# Altium project Pmod_8LD.PrjPcb
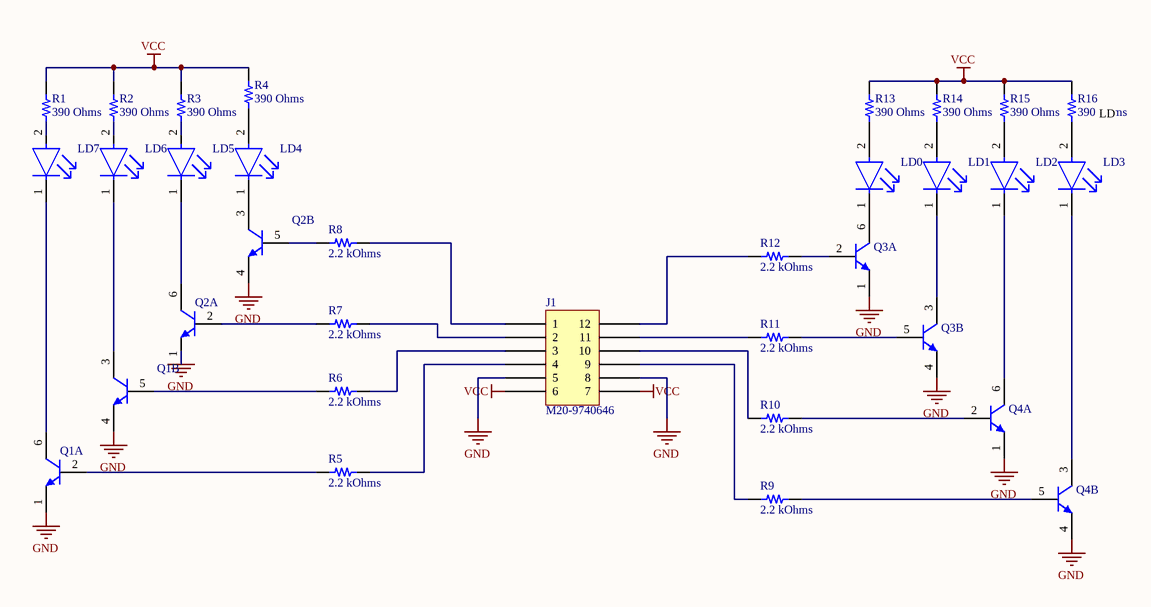
[diagram p0: Pmod_8LD.SchDoc]
1 sheet, 29 parts. Net scope: global (net labels, ports and power ports of the same name join across sheets).
Board file: Pmod_8LD.PcbDoc

## Sheet Pmod_8LD.SchDoc
size A4; SheetNumber: 1; SheetTotal: 1

### Parts
J1  M20-9740646  [HARWIN M20-9740645]
LD0  HSMG-C191  [FP-HSMG-C191-MFG]  (value not drawn)
LD1  HSMG-C191  [FP-HSMG-C191-MFG]  (value not drawn)
LD2  HSMG-C191  [FP-HSMG-C191-MFG]  (value not drawn)
LD3  HSMG-C191  [FP-HSMG-C191-MFG]  (value not drawn)
LD4  HSMG-C191  [FP-HSMG-C191-MFG]  (value not drawn)
LD5  HSMG-C191  [FP-HSMG-C191-MFG]  (value not drawn)
LD6  HSMG-C191  [FP-HSMG-C191-MFG]  (value not drawn)
LD7  HSMG-C191  [FP-HSMG-C191-MFG]  (value not drawn)
Q1  BC846BDW1T1G  [ONSC-SOT-363-6-419B-02_W_V]  (value not drawn)  (parts A,B of 2)
Q2  BC846BDW1T1G  [ONSC-SOT-363-6-419B-02_W_V]  (value not drawn)  (parts A,B of 2)
Q3  BC846BDW1T1G  [ONSC-SOT-363-6-419B-02_W_V]  (value not drawn)  (parts A,B of 2)
Q4  BC846BDW1T1G  [ONSC-SOT-363-6-419B-02_W_V]  (value not drawn)  (parts A,B of 2)
R1  390 Ohms  [RES 0805_2012]
R2  390 Ohms  [RES 0805_2012]
R3  390 Ohms  [RES 0805_2012]
R4  390 Ohms  [RES 0805_2012]
R5  2.2 kOhms  [RES 0805_2012]
R6  2.2 kOhms  [RES 0805_2012]
R7  2.2 kOhms  [RES 0805_2012]
R8  2.2 kOhms  [RES 0805_2012]
R9  2.2 kOhms  [RES 0805_2012]
R10  2.2 kOhms  [RES 0805_2012]
R11  2.2 kOhms  [RES 0805_2012]
R12  2.2 kOhms  [RES 0805_2012]
R13  390 Ohms  [RES 0805_2012]
R14  390 Ohms  [RES 0805_2012]
R15  390 Ohms  [RES 0805_2012]
R16  390 Ohms  [RES 0805_2012]

### Nets
GND: J1.5 J1.8 Q1.1(E) Q1.4(E) Q2.1(E) Q2.4(E) Q3.1(E) Q3.4(E) Q4.1(E) Q4.4(E)
VCC: J1.6 J1.7 R1.1 R2.1 R3.1 R4.1 R13.1 R14.1 R15.1 R16.1
NetJ1_1: J1.1 R8.1
NetJ1_2: J1.2 R7.1
NetJ1_3: J1.3 R6.1
NetJ1_4: J1.4 R5.1
NetJ1_9: J1.9 R9.2
NetJ1_10: J1.10 R10.2
NetJ1_11: J1.11 R11.2
NetJ1_12: J1.12 R12.2
NetLD0_1: LD0.1(C) Q3.6(C)
NetLD0_2: LD0.2(A) R13.2
NetLD1_1: LD1.1(C) Q3.3(C)
NetLD1_2: LD1.2(A) R14.2
NetLD2_1: LD2.1(C) Q4.6(C)
NetLD2_2: LD2.2(A) R15.2
NetLD3_1: LD3.1(C) Q4.3(C)
NetLD3_2: LD3.2(A) R16.2
NetLD4_1: LD4.1(C) Q2.3(C)
NetLD4_2: LD4.2(A) R4.2
NetLD5_1: LD5.1(C) Q2.6(C)
NetLD5_2: LD5.2(A) R3.2
NetLD6_1: LD6.1(C) Q1.3(C)
NetLD6_2: LD6.2(A) R2.2
NetLD7_1: LD7.1(C) Q1.6(C)
NetLD7_2: LD7.2(A) R1.2
NetQ1_2: Q1.2(B) R5.2
NetQ1_5: Q1.5(B) R6.2
NetQ2_2: Q2.2(B) R7.2
NetQ2_5: Q2.5(B) R8.2
NetQ3_2: Q3.2(B) R12.1
NetQ3_5: Q3.5(B) R11.1
NetQ4_2: Q4.2(B) R10.1
NetQ4_5: Q4.5(B) R9.1

### Notes on the sheet
- (near R16) LD

### Library data of the parts
J1 = M20-9740646: CONN HEADER R/A 12POS 2.54MM; Manufacturer: Harwin Inc.; Connector Type: Header, Cuttable; Current Rating (Amps): 3A per Contact; Material Flammability Rating: UL94 V-0; Number of Positions: 12; Number of Positions Loaded: All; Shrouding: Unshrouded; Style: Board to Board or Cable; Part Number: M20-9740646; ComponentLink1Description: Datasheet; ComponentLink1URL: https://cdn.harwin.com/pdfs/M20-974.pdf; ComponentLink2Description: DigiKey Link; ComponentLink2URL: http://digikey.com/product-detail/en/harwin-inc/M20-9740646/M20-9740646-ND/3920719; Contact Finish - Mating: Tin; Contact Finish - Post: Tin; Contact Material: Brass; Contact Shape: Square; Contact Type: Male Pin; Fastening Type: Push-Pull; Insulation Color: Black; Insulation Material: Polyamide (PA6T), Nylon 6T; LastUpdated: 21.09.2022 19:18:29; Lifecycle Status: Active; Minimum Order: 1500; Mounting Type: Through Hole, Right Angle; Number of Rows: 2; Operating Temperature: -40°C ~ 105°C; Packaging: Bulk; PartId: 159; Part Status: Active; Price: 0.27; Series: M20; Supplier 1: DigiKey; Supplier Part Number 1: M20-9740646-ND; Termination: Solder
LD0-LD7 = CMP-18399-000001-1: LED GREEN DIFFUSED CHIP SMD; Manufacturer: Broadcom; Viewing Angle: 170°; Max Junction Temp: +95°C; Wavelength: 572nm; Peak Emmision Wavelength: 570nm; Led Orientation: Top View; Luminous Intensity: 15mcd; Reverse Voltage: 5V; Forward Current: 20mA; Forward Voltage: 2.2V; Power Dissipation: 52mW; Ipc Land Pattern Name: DIOC16080X45; Digikey Description: LED GREEN DIFFUSED CHIP SMD; Temperature Range High: +85°C; Height: 0.7mm; Automotive: No; Footprint 0 Description: SM LED; 2 Flat Leads; Device Class L3: unset; ComponentLink2Description: Datasheet; Lead Free: Yes; Package: 0; Mouser Description: LED Uni-Color Green 570nm 2-Pin Chip LED T/R; RoHS: TRUE; Category: Diode; Manufacturer Part Number: HSMG-C191; Device Class L1: Optoelectronics; Temperature Range Low: -40°C; Device Class L2: LEDs; Colour: Green; Octopart: https://octopart.com/hsmg-c191-broadcom-71131308; Temperature: -40°C to +85°C; ComponentLink2URL: https://docs.broadcom.com/docs/AV02-0551EN
Q1-Q4 = CMP-1048-00850-1: Dual General Purpose Transistors, NPN, 6-Pin SOT-363, Pb-Free, Tape and Reel; Manufacturer: On Semiconductor; IC Continuous (A): 0.1; fT Min (MHz): 100; Polarity: Dual NPN; PartNumber: BC846BDW1T1G; ComponentLink3Description: Package Specification; PackageVersion: Rev. W, 01/2006; ComponentLink2URL: http://www.onsemi.cn/pub_link/Collateral/BC846BDW1T1-D.PDF; PackageDescription: 6-Pin Small Outline Transistor, Body 2 x 1.25 mm, Pitch 0.65 mm; ComponentLink2Description: Datasheet; PackageReference: SOT-363-6-419B-02_W; RoHS: TRUE; ComponentLink3URL: http://www.onsemi.com/pub_link/Collateral/NTJD4001N-D.PDF; DatasheetVersion: Rev. 9; ComponentLink1Description: Manufacturer URL; Mounting Technology: Surface Mount; Packing: Tape and Reel; ComponentLink1URL: http://www.onsemi.com/
R1-R4 R13-R16 = AC0805JR-07390RL: RES SMD 390 OHM 5% 1/8W 0805; Manufacturer: Yageo; Power (Watts): 0.125W, 1/8W; Temperature Coefficient: ±100ppm/°C; Part Number: AC0805JR-07390RL; Value: 390 Ohms; ComponentLink1Description: Datasheet; ComponentLink1URL: https://www.yageo.com/upload/media/product/productsearch/datasheet/rchip/PYu-AC_51_RoHS_L_7.pdf; ComponentLink2Description: DigiKey Link; ComponentLink2URL: https://www.digikey.com/en/products/detail/yageo/AC0805JR-07390RL/5897130; Composition: Thick Film; Device Package: 0805 (2012 Metric); Features: Automotive AEC-Q200, Moisture Resistant; Height - Seated (Max): 0.024" (0.60mm); LastUpdated: 13.07.2023 19:38:07; Lifecycle Status: Active; Minimum Order: 1; Number of Terminations: 2; Operating Temperature: -55°C ~ 155°C; Package / Case: 0805 (2012 Metric); Packaging: TapeAndReel; PartId: 46464; Part Status: Active; Price: 0.01; Ratings: AEC-Q200; Resistance: 390 Ohms; Series: AC; Size / Dimension: 0.079" L x 0.049" W (2.00mm x 1.25mm); Supplier 1: DigiKey; Supplier Part Number 1: YAG3786CT-ND; Supplier Device Package: 0805; Tolerance: ±5%
R5-R12 = RG2012L-222-L-T05: RES SMD 2.2KOHM 0.01% 1/10W 0805; Manufacturer: Susumu; Power (Watts): 0.1W, 1/10W; Temperature Coefficient: ±2ppm/°C; Part Number: RG2012L-222-L-T05; Value: 2.2 kOhms; ComponentLink1Description: Datasheet; ComponentLink1URL: http://www.susumu-usa.com/pdf/FootPrint_8_9.pdf; ComponentLink2Description: DigiKey Link; ComponentLink2URL: https://www.digikey.com/en/products/detail/susumu/RG2012L-222-L-T05/3738063; Composition: Thin Film; Device Package: 0805 (2012 Metric); Features: Anti-Sulfur, Automotive AEC-Q200; Height - Seated (Max): 0.020" (0.50mm); LastUpdated: 13.07.2023 19:38:21; Lifecycle Status: Active; Minimum Order: 1; Number of Terminations: 2; Operating Temperature: -55°C ~ 155°C; Package / Case: 0805 (2012 Metric); Packaging: TapeAndReel; PartId: 40974; Part Status: Active; Price: 1.76; Ratings: AEC-Q200; Resistance: 2.2 kOhms; Series: RG; Size / Dimension: 0.079" L x 0.049" W (2.00mm x 1.25mm); Supplier 1: DigiKey; Supplier Part Number 1: 408-1635-1-ND; Supplier Device Package: 0805; Tolerance: ±0.01%